# Altium project DIGITAL COUNTER.PrjPCB
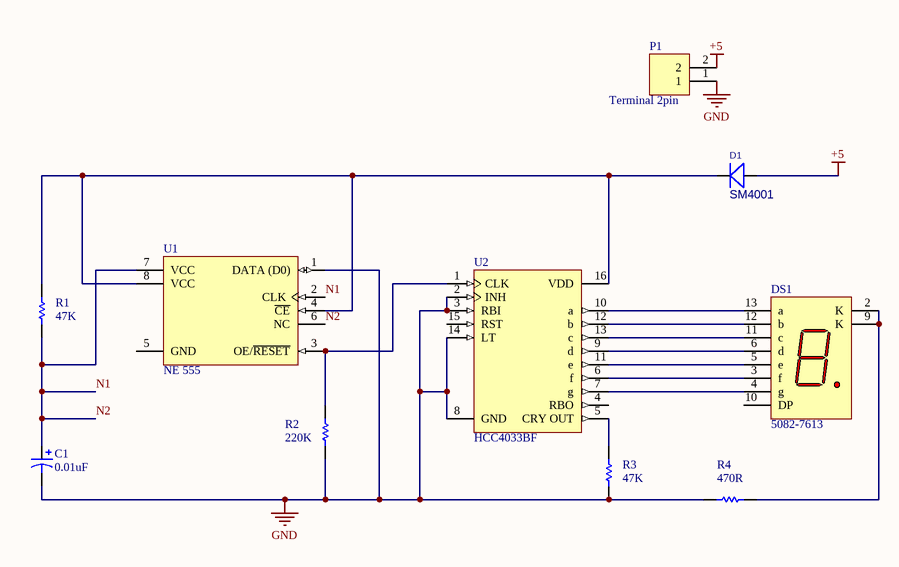
[diagram p0: DIGITAL COUNTER.SchDoc]
1 sheet, 10 parts. Net scope: global (net labels, ports and power ports of the same name join across sheets).
Board files: DIGITAL COUNTER.PcbDoc, PCB1.PcbDoc

## Sheet DIGITAL COUNTER.SchDoc
size A

### Parts
C1  0.01uF  [Cap 0810]
D1  SM4001  [DIODE_DO-213AB]
DS1  5082-7613  [A-10(14)]
P1  Terminal 2pin  [Terminal 2pin]
R1  47K  [R_1206]
R2  220K  [R_1206]
R3  47K  [R_1206]
R4  470R  [R_1206]
U1  NE 555  [SO-8]
U2  HCC4033BF  [SOIC16_M]

### Nets
+5: D1.1(A) P1.2
GND: C1.2 P1.1 R2.2 R3.2 R4.2 U1.1(DATA_(D0)) U2.2(INH) U2.3(RBI) U2.8(GND) U2.14(LT)
N1: C1.1 R1.1 U1.2(CLK) U1.6(NC) U1.7(VCC)  [also labelled N2]
NetD1_2: D1.2(K) R1.2 U1.4(~{CE}) U1.8(VCC) U2.16(VDD)
NetDS1_2: DS1.2(K) DS1.9(K) R4.1
NetDS1_3: DS1.3(f) U2.6(f)
NetDS1_4: DS1.4(g) U2.7(g)
NetDS1_5: DS1.5(e) U2.11(e)
NetDS1_6: DS1.6(d) U2.9(d)
NetDS1_11: DS1.11(c) U2.13(c)
NetDS1_12: DS1.12(b) U2.12(b)
NetDS1_13: DS1.13(a) U2.10(a)
NetR2_1: R2.1 U1.3(OE/~{RESET}) U2.1(CLK)
NetR3_1: R3.1 U2.5(CRY_OUT)

Not connected (* = marked no-connect by the designer): DS1 10(DP); U1 5(GND); U2 4(RBO) 15(RST)

### Library data of the parts
C1 = Cap 220uF
D1 = D_DO-213: Diode
DS1 = 5082-7613: 7.62 mm HER 7-Segment Display: CC, RH DP; LuminousIntensity: 340 ucd (Minimum).; LED_Colour: High Efficiency Red (HER); Note: Pins 2 and 9 are redundant Cathodes.; Note: No pins are present in positions 1, 7, 8 and 14.; Published: 26-May-2004; LatestRevisionDate: 11-Oct-2004; LatestRevisionNote: Display outline superimposed on PCB Footprint.; DatasheetDocument: 27-Aug-2001; PackageDocument: 27-Aug-2001; PackageReference: A-10(14); Publisher: Altium Limited; ComponentLink1Description: Manufacturer Link; ComponentLink1URL: http://www.agilent.com/; ComponentLink2Description: Datasheet; ComponentLink2URL: http://cp.literature.agilent.com/litweb/pdf/5988-3325EN.pdf
R1-R4 = RES
U1 = XC17S05VO8C: XC17S00 Series, One-Time Programmable Configuration 5V PROM, 8-Pin TSOP, XCS05 Compatible, Commercial Grade; Published: 17-Dec-2003; LatestRevisionDate: 16-Nov-2009; LatestRevisionNote: Updated to datasheet version 1.12, Jun-2008.; DatasheetVersion: ver1.12, Jun-2008; PackageVersion: ver1.1, Apr-2001; PackageReference: VO8; Publisher: Altium Limited; PackageDescription: 8-Pin Thin Small Outline Package (VO8); Supplier 1: Digi-Key; Supplier Part Number 1: XC17S05VO8C-ND; ComponentLink1Description: XC17S00/XL Datasheet; ComponentLink1URL: http://www.xilinx.com/support/documentation/data_sheets/ds030.pdf; ComponentLink2Description: VO8 Package Drawing; ComponentLink2URL: http://www.xilinx.com/support/documentation/package_specs/vo8.pdf; ComponentLink3Description: Configuration PROM Documents; ComponentLink3URL: http://www.xilinx.com/support/documentation/configuration_proms.htm; ComponentLink4Description: Xilinx.com Home; ComponentLink4URL: http://www.xilinx.com
U2 = HCC4033BF: Decade Counter / Divider with Decoded 7-Segment Display Output; Published: 8-Jun-2000; LatestRevisionDate: 06-Jun-2005; LatestRevisionNote: Stylized 3D Model Added.; DatasheetVersion: Sep-1988; PackageVersion: Apr-1996; PackageReference: DIP16; Publisher: Altium Limited; PackageDescription: DIP; 16 Leads; Row Spacing 7.62 mm; Pitch 2.54 mm; ComponentLink1Description: Manufacturer Link; ComponentLink1URL: http://www.st.com/